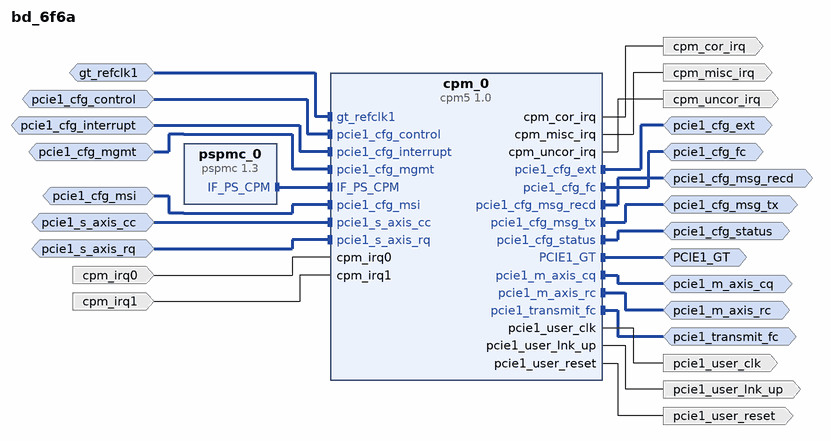
[diagram p0: block diagram of the top level]
# Vivado block design bd_6f6a, xcvp1202-vsva2785-2MHP-e-S-es1, Vivado 2023.1
create_bd_design bd_6f6a

create_bd_intf_port -mode Slave -vlnv xilinx.com:interface:pcie5_cfg_control_rtl:1.0 pcie1_cfg_control
create_bd_intf_port -mode Slave -vlnv xilinx.com:interface:pcie3_cfg_interrupt_rtl:1.0 pcie1_cfg_interrupt
create_bd_intf_port -mode Slave -vlnv xilinx.com:interface:axis_rtl:1.0 pcie1_s_axis_rq
set_property -dict {CONFIG.FREQ_HZ 250000000} [get_bd_intf_ports pcie1_s_axis_rq]
create_bd_intf_port -mode Slave -vlnv xilinx.com:interface:axis_rtl:1.0 pcie1_s_axis_cc
set_property -dict {CONFIG.FREQ_HZ 250000000} [get_bd_intf_ports pcie1_s_axis_cc]
create_bd_intf_port -mode Master -vlnv xilinx.com:interface:axis_rtl:1.0 pcie1_m_axis_rc
set_property -dict {CONFIG.FREQ_HZ 250000000} [get_bd_intf_ports pcie1_m_axis_rc]
create_bd_intf_port -mode Master -vlnv xilinx.com:interface:axis_rtl:1.0 pcie1_m_axis_cq
set_property -dict {CONFIG.FREQ_HZ 250000000} [get_bd_intf_ports pcie1_m_axis_cq]
create_bd_intf_port -mode Slave -vlnv xilinx.com:interface:pcie4_cfg_mgmt_rtl:1.0 pcie1_cfg_mgmt
create_bd_intf_port -mode Slave -vlnv xilinx.com:interface:pcie3_cfg_msi_rtl:1.0 pcie1_cfg_msi
create_bd_intf_port -mode Master -vlnv xilinx.com:interface:pcie3_cfg_ext_rtl:1.0 pcie1_cfg_ext
create_bd_intf_port -mode Master -vlnv xilinx.com:interface:pcie_cfg_fc_rtl:1.1 pcie1_cfg_fc
create_bd_intf_port -mode Master -vlnv xilinx.com:interface:pcie3_cfg_mesg_tx_rtl:1.0 pcie1_cfg_msg_tx
create_bd_intf_port -mode Master -vlnv xilinx.com:interface:pcie5_cfg_status_rtl:1.0 pcie1_cfg_status
create_bd_intf_port -mode Master -vlnv xilinx.com:interface:pcie3_transmit_fc_rtl:1.0 pcie1_transmit_fc
create_bd_intf_port -mode Master -vlnv xilinx.com:interface:pcie3_cfg_msg_received_rtl:1.0 pcie1_cfg_msg_recd
create_bd_intf_port -mode Master -vlnv xilinx.com:interface:gt_rtl:1.0 PCIE1_GT
create_bd_intf_port -mode Slave -vlnv xilinx.com:interface:diff_clock_rtl:1.0 gt_refclk1
set_property -dict {CONFIG.FREQ_HZ 100000000} [get_bd_intf_ports gt_refclk1]
create_bd_port -dir O -type clk pcie1_user_clk
set_property -dict {CONFIG.ASSOCIATED_RESET pcie1_user_reset CONFIG.FREQ_HZ 250000000} [get_bd_ports pcie1_user_clk]
create_bd_port -dir O -type intr cpm_misc_irq
create_bd_port -dir O -type intr cpm_cor_irq
create_bd_port -dir O -type intr cpm_uncor_irq
create_bd_port -dir I -type intr cpm_irq0
create_bd_port -dir I -type intr cpm_irq1
create_bd_port -dir O -type rst pcie1_user_reset
set_property -dict {CONFIG.POLARITY ACTIVE_HIGH} [get_bd_ports pcie1_user_reset]
create_bd_port -dir O pcie1_user_lnk_up

create_bd_cell -type ip -vlnv xilinx.com:ip:pspmc:1.3 pspmc_0
